# Altium schematic sheet [09] - CPU GPIO.SchDoc
size A4; DocumentNumber: 9; SheetNumber: 9; SheetTotal: 9
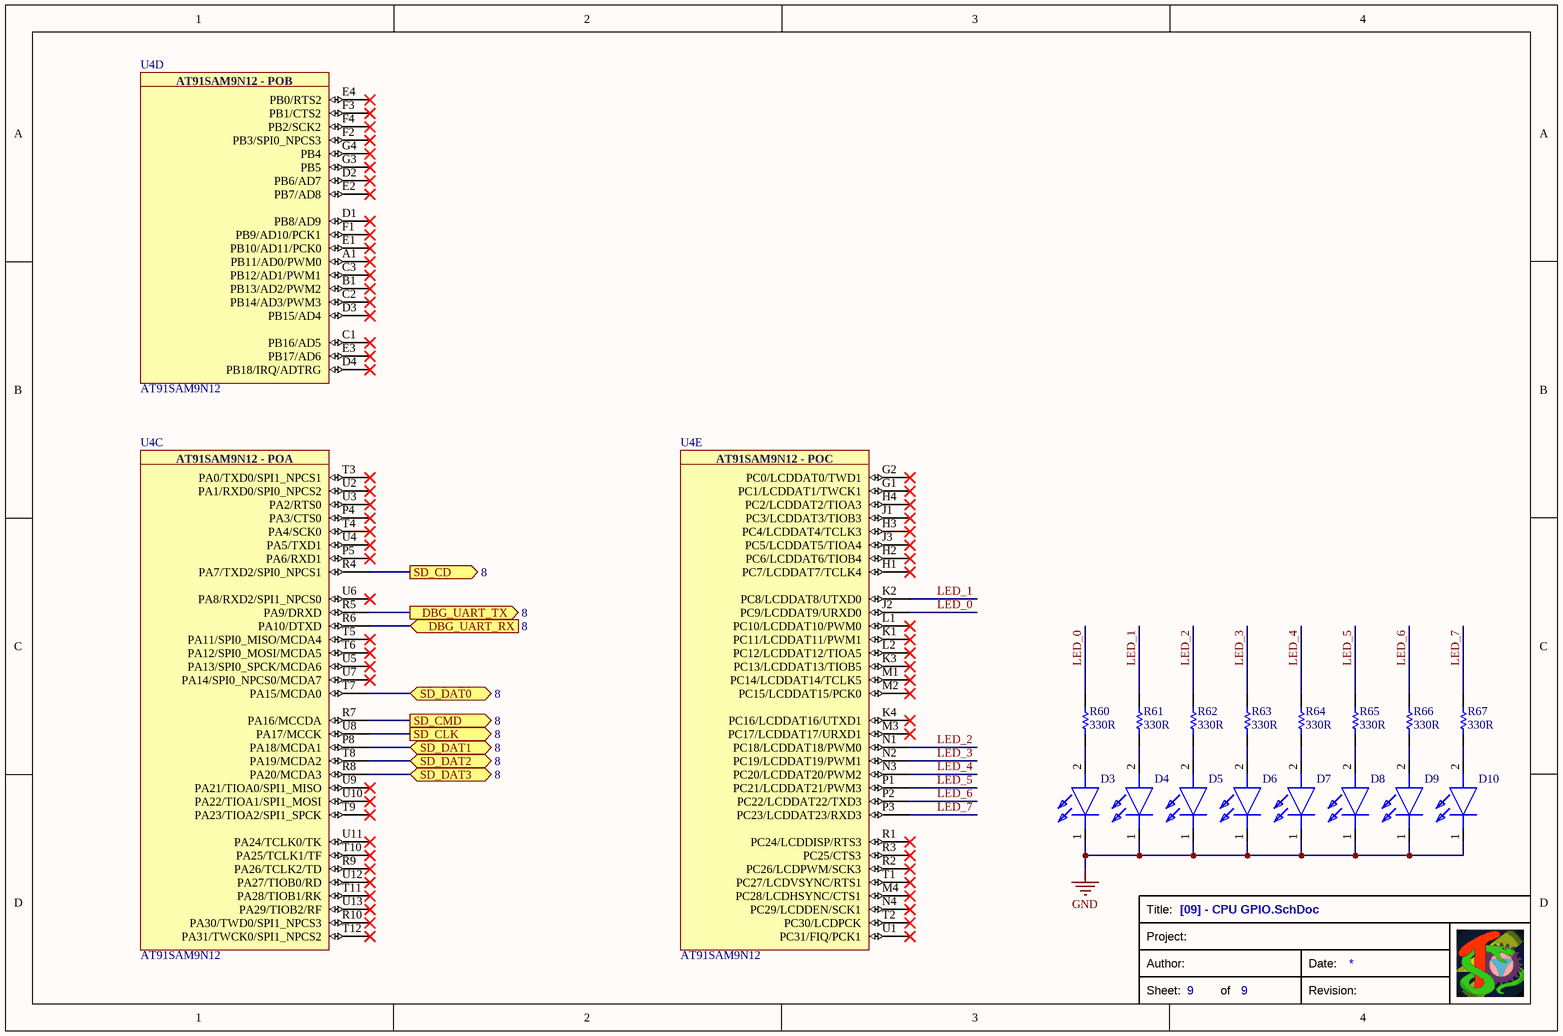
[diagram p0: [09] - CPU GPIO.SchDoc]

## Parts
D3  150060VS75000  [LED-SMD-0603-1.6X0.8]  (value not drawn)
D4  150060VS75000  [LED-SMD-0603-1.6X0.8]  (value not drawn)
D5  150060VS75000  [LED-SMD-0603-1.6X0.8]  (value not drawn)
D6  150060VS75000  [LED-SMD-0603-1.6X0.8]  (value not drawn)
D7  150060VS75000  [LED-SMD-0603-1.6X0.8]  (value not drawn)
D8  150060VS75000  [LED-SMD-0603-1.6X0.8]  (value not drawn)
D9  150060VS75000  [LED-SMD-0603-1.6X0.8]  (value not drawn)
D10  150060VS75000  [LED-SMD-0603-1.6X0.8]  (value not drawn)
R60  value 330R  [RES-0603]  (hidden comment: RT0603FRD07330RL)
R61  value 330R  [RES-0603]  (hidden comment: RT0603FRD07330RL)
R62  value 330R  [RES-0603]  (hidden comment: RT0603FRD07330RL)
R63  value 330R  [RES-0603]  (hidden comment: RT0603FRD07330RL)
R64  value 330R  [RES-0603]  (hidden comment: RT0603FRD07330RL)
R65  value 330R  [RES-0603]  (hidden comment: RT0603FRD07330RL)
R66  value 330R  [RES-0603]  (hidden comment: RT0603FRD07330RL)
R67  value 330R  [RES-0603]  (hidden comment: RT0603FRD07330RL)
U4  AT91SAM9N12  [BGA0.8P17X17_217_15X15]  (parts C,D,E of 6)

## Ports
DBG_UART_RX (in, see 8), DBG_UART_TX (out, see 8), SD_CD (out, see 8), SD_CLK (out, see 8), SD_CMD (out, see 8), SD_DAT0 (bidir, see 8), SD_DAT1 (bidir, see 8), SD_DAT2 (bidir, see 8), SD_DAT3 (bidir, see 8)

## Nets
GND: D3.1(K) D4.1(K) D5.1(K) D6.1(K) D7.1(K) D8.1(K) D9.1(K) D10.1(K)
DBG_UART_RX: U4.R6(PA10/DTXD) ; port DBG_UART_RX
DBG_UART_TX: U4.R5(PA9/DRXD) ; port DBG_UART_TX
LED_0: R60.2 U4.J2(PC9/LCDDAT9/URXD0)
LED_1: R61.2 U4.K2(PC8/LCDDAT8/UTXD0)
LED_2: R62.2 U4.N1(PC18/LCDDAT18/PWM0)
LED_3: R63.2 U4.N2(PC19/LCDDAT19/PWM1)
LED_4: R64.2 U4.N3(PC20/LCDDAT20/PWM2)
LED_5: R65.2 U4.P1(PC21/LCDDAT21/PWM3)
LED_6: R66.2 U4.P2(PC22/LCDDAT22/TXD3)
LED_7: R67.2 U4.P3(PC23/LCDDAT23/RXD3)
SD_CD: U4.R4(PA7/TXD2/SPI0_NPCS1) ; port SD_CD
SD_CLK: U4.U8(PA17/MCCK) ; port SD_CLK
SD_CMD: U4.R7(PA16/MCCDA) ; port SD_CMD
SD_DAT0: U4.T7(PA15/MCDA0) ; port SD_DAT0
SD_DAT1: U4.P8(PA18/MCDA1) ; port SD_DAT1
SD_DAT2: U4.T8(PA19/MCDA2) ; port SD_DAT2
SD_DAT3: U4.R8(PA20/MCDA3) ; port SD_DAT3
NetD3_2: D3.2(A) R60.1
NetD4_2: D4.2(A) R61.1
NetD5_2: D5.2(A) R62.1
NetD6_2: D6.2(A) R63.1
NetD7_2: D7.2(A) R64.1
NetD8_2: D8.2(A) R65.1
NetD9_2: D9.2(A) R66.1
NetD10_2: D10.2(A) R67.1

Not connected (* = marked no-connect by the designer): U4 A1(PB11/AD0/PWM0)* B1(PB13/AD2/PWM2)* C1(PB16/AD5)* C2(PB14/AD3/PWM3)* C3(PB12/AD1/PWM1)* D1(PB8/AD9)* D2(PB6/AD7)* D3(PB15/AD4)* D4(PB18/IRQ/ADTRG)* E1(PB10/AD11/PCK0)* E2(PB7/AD8)* E3(PB17/AD6)* E4(PB0/RTS2)* F1(PB9/AD10/PCK1)* F2(PB3/SPI0_NPCS3)* F3(PB1/CTS2)* F4(PB2/SCK2)* G1(PC1/LCDDAT1/TWCK1)* G2(PC0/LCDDAT0/TWD1)* G3(PB5)* G4(PB4)* H1(PC7/LCDDAT7/TCLK4)* H2(PC6/LCDDAT6/TIOB4)* H3(PC4/LCDDAT4/TCLK3)* H4(PC2/LCDDAT2/TIOA3)* J1(PC3/LCDDAT3/TIOB3)* J3(PC5/LCDDAT5/TIOA4)* K1(PC11/LCDDAT11/PWM1)* K3(PC13/LCDDAT13/TIOB5)* K4(PC16/LCDDAT16/UTXD1)* L1(PC10/LCDDAT10/PWM0)* L2(PC12/LCDDAT12/TIOA5)* M1(PC14/LCDDAT14/TCLK5)* M2(PC15/LCDDAT15/PCK0)* M3(PC17/LCDDAT17/URXD1)* M4(PC28/LCDHSYNC/CTS1)* N4(PC29/LCDDEN/SCK1)* P4(PA3/CTS0)* P5(PA6/RXD1)* R1(PC24/LCDDISP/RTS3)* R2(PC26/LCDPWM/SCK3)* R3(PC25/CTS3)* R9(PA26/TCLK2/TD)* R10(PA30/TWD0/SPI1_NPCS3)* T1(PC27/LCDVSYNC/RTS1)* T2(PC30/LCDPCK)* T3(PA0/TXD0/SPI1_NPCS1)* T4(PA4/SCK0)* T5(PA11/SPI0_MISO/MCDA4)* T6(PA12/SPI0_MOSI/MCDA5)* T9(PA23/TIOA2/SPI1_SPCK)* T10(PA25/TCLK1/TF)* T11(PA28/TIOB1/RK)* T12(PA31/TWCK0/SPI1_NPCS2)* U1(PC31/FIQ/PCK1)* U2(PA1/RXD0/SPI0_NPCS2)* U3(PA2/RTS0)* U4(PA5/TXD1)* U5(PA13/SPI0_SPCK/MCDA6)* U6(PA8/RXD2/SPI1_NPCS0)* U7(PA14/SPI0_NPCS0/MCDA7)* U9(PA21/TIOA0/SPI1_MISO)* U10(PA22/TIOA1/SPI1_MOSI)* U11(PA24/TCLK0/TK)* U12(PA27/TIOB0/RD)* U13(PA29/TIOB2/RF)*

## Notes on the sheet
- Title:
- Project:
- Sheet:
- Author:
- of
- Revision:
- Date:
- (in symbol AT91SAM9N12, part C) AT91SAM9N12 - POA
- (in symbol AT91SAM9N12, part D) AT91SAM9N12 - POB
- (in symbol AT91SAM9N12, part E) AT91SAM9N12 - POC

## Library data of the parts
D3-D10 = LED-SMD-0603-Green-150060VS75000: Standard LEDs - SMD WL-SMCW SMDMono TpVw Waterclr 0603 BrtGrn; Value: Green; Supplier 1: Mouser; Supplier Part Number 1: 710-150060VS75000
R60-R67 = RES-0603-330R-RT0603FRD07330RL: Thin Film Resistors - SMD 1/10W 330 ohm 1% 50ppm; Manufacturer: Yageo; Supplier 1: Mouser; Supplier Part Number 1: 603-RT0603FRD07330RL
U4 = AT91SAM9N12: MPU ARM926EJ-S 400MHz; Supplier 1: Mouser; Supplier Part Number 1: 556-AT91SAM9N12-CU